# EAGLE design MainBoard (EAGLE 9.5.1)

## Sheet 1 of 5
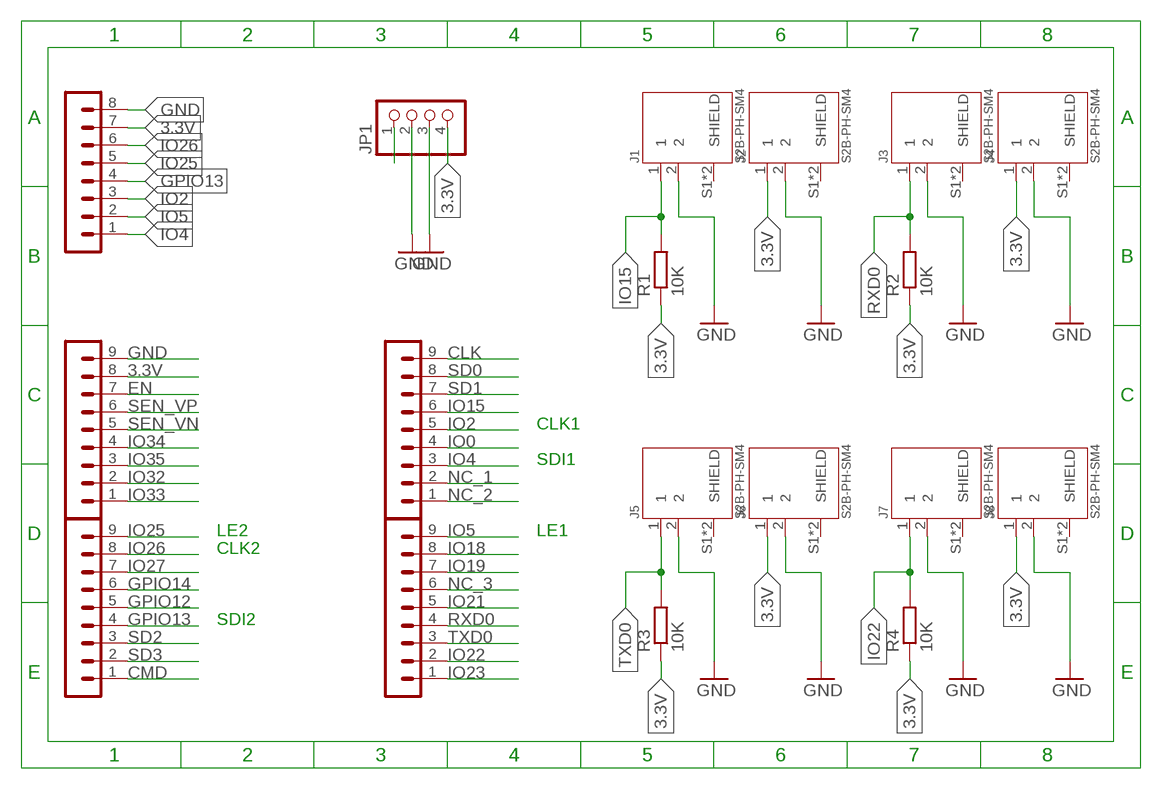
[diagram p0: schematic, sheet 1]

### Parts
J1  S2B-PH-SM4  [JST_S2B-PH-SM4-TB(LF)(SN)]
J2  S2B-PH-SM4  [JST_S2B-PH-SM4-TB(LF)(SN)]
J3  S2B-PH-SM4  [JST_S2B-PH-SM4-TB(LF)(SN)]
J4  S2B-PH-SM4  [JST_S2B-PH-SM4-TB(LF)(SN)]
J5  S2B-PH-SM4  [JST_S2B-PH-SM4-TB(LF)(SN)]
J6  S2B-PH-SM4  [JST_S2B-PH-SM4-TB(LF)(SN)]
J7  S2B-PH-SM4  [JST_S2B-PH-SM4-TB(LF)(SN)]
J8  S2B-PH-SM4  [JST_S2B-PH-SM4-TB(LF)(SN)]
JP1  PINHD-1X4  [1X04]
R1  10K  R-EU_1206R1206  [R1206]
R2  10K  R-EU_1206R1206  [R1206]
R3  10K  R-EU_1206R1206  [R1206]
R4  10K  R-EU_1206R1206  [R1206]
SV2  PINHEADER-1X9  [MA09-1]
SV3  PINHEADER-1X9  [MA09-1]
SV4  PINHEADER-1X8  [MA08-1]
SV5  PINHEADER-1X9  [MA09-1]
SV6  PINHEADER-1X9  [MA09-1]

### Nets
3.3V: J2.1 J4.1 J6.1 J8.1 JP1.4 R1.1 R2.1 R3.1 R4.1 SV4.7 SV5.8
CLK: SV2.9
CMD: SV6.1
EN [other]: SV5.7
GND: J1.2 J2.2 J3.2 J4.2 J5.2 J6.2 J7.2 J8.2 JP1.2 JP1.3 SV4.8 SV5.9
GPIO12: SV6.5
GPIO13: SV4.4 SV6.4
GPIO14: SV6.6
IO0 [other]: SV2.4
IO2: SV2.5 SV4.3
IO4: SV2.3 SV4.1
IO5: SV3.9 SV4.2
IO15: J1.1 R1.2 SV2.6
IO18: SV3.8
IO19: SV3.7
IO21: SV3.5
IO22: J7.1 R4.2 SV3.2
IO23: SV3.1
IO25: SV4.5 SV6.9
IO26: SV4.6 SV6.8
IO27: SV6.7
IO32: SV5.2
IO33: SV5.1
IO34: SV5.4
IO35: SV5.3
NC: JP1.1
NC_1: SV2.2
NC_2: SV2.1
NC_3: SV3.6
RXD0 [other]: J3.1 R2.2 SV3.4
SD0: SV2.8
SD1: SV2.7
SD2: SV6.3
SD3: SV6.2
SEN_VN: SV5.5
SEN_VP: SV5.6
TXD0 [other]: J5.1 R3.2 SV3.3
Unconnected: J1.S1(SHIELD) J1.S2(SHIELD) J2.S1(SHIELD) J2.S2(SHIELD) J3.S1(SHIELD) J3.S2(SHIELD) J4.S1(SHIELD) J4.S2(SHIELD) J5.S1(SHIELD) J5.S2(SHIELD) J6.S1(SHIELD) J6.S2(SHIELD) J7.S1(SHIELD) J7.S2(SHIELD) J8.S1(SHIELD) J8.S2(SHIELD)

### Notes on the sheet
- CLK1
- SDI1
- LE2 | LE1
- CLK2
- SDI2

## Sheet 2 of 5
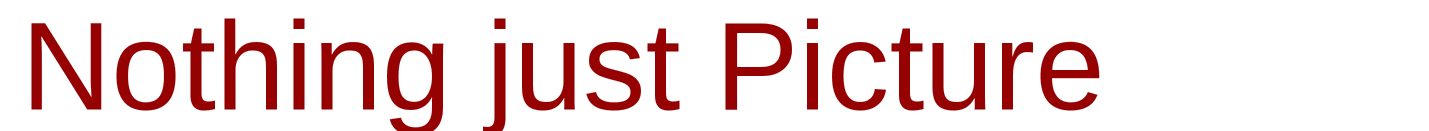
[diagram p1: schematic, sheet 2]

### Notes on the sheet
- Nothing just Picture

## Sheet 3 of 5

## Sheet 4 of 5
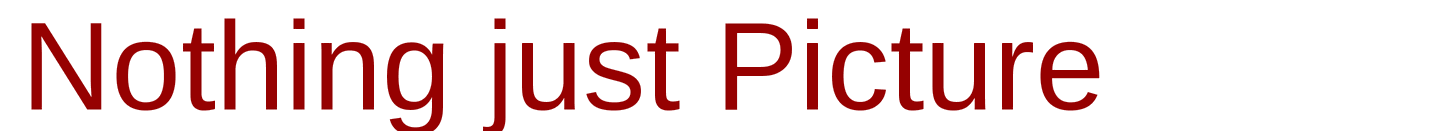
[diagram p2: schematic, sheet 4]

### Notes on the sheet
- Nothing just Picture

## Sheet 5 of 5

## Library data of the parts
J1-J8 = CommonParts:S2B-PH-SM4: PH Series 2 Position 2 mm Pitch Surface Mount Side Entry Shrouded Header; DESCRIPTION: PH Series 2 Position 2 mm Pitch Surface Mount Side Entry Shrouded Header; DIGI-KEY_PART_NUMBER: 455-1749-1-ND; DIGI-KEY_PURCHASE_URL: https://www.digikey.com/product-detail/en/jst-sales-america-inc/S2B-PH-SM4-TB_LF__SN_/455-1749-1-ND/926846?utm_source=snapeda&utm_medium=aggregator&utm_campaign=symbol; MF: JST Sales; MP: S2B-PH-SM4-TB_LF__SN_; PACKAGE: None
JP1 = pinhead:PINHD-1X4: PIN HEADER
R1-R4 = CommonParts:R-EU_1206: RESISTOR, European symbol
SV2 SV3 SV5 SV6 = CommonParts:PINHEADER-1X9: PIN HEADER; OC_FARNELL: unknown; OC_NEWARK: unknown
SV4 = CommonParts:PINHEADER-1X8: PIN HEADER; OC_FARNELL: unknown; OC_NEWARK: unknown

## Net classes
0 default: width 0.2 mm, drill 0.6 mm, clearance 0.2 mm
1 other: width 0.2 mm, drill 0.2 mm, clearance 0.1 mm

## Board
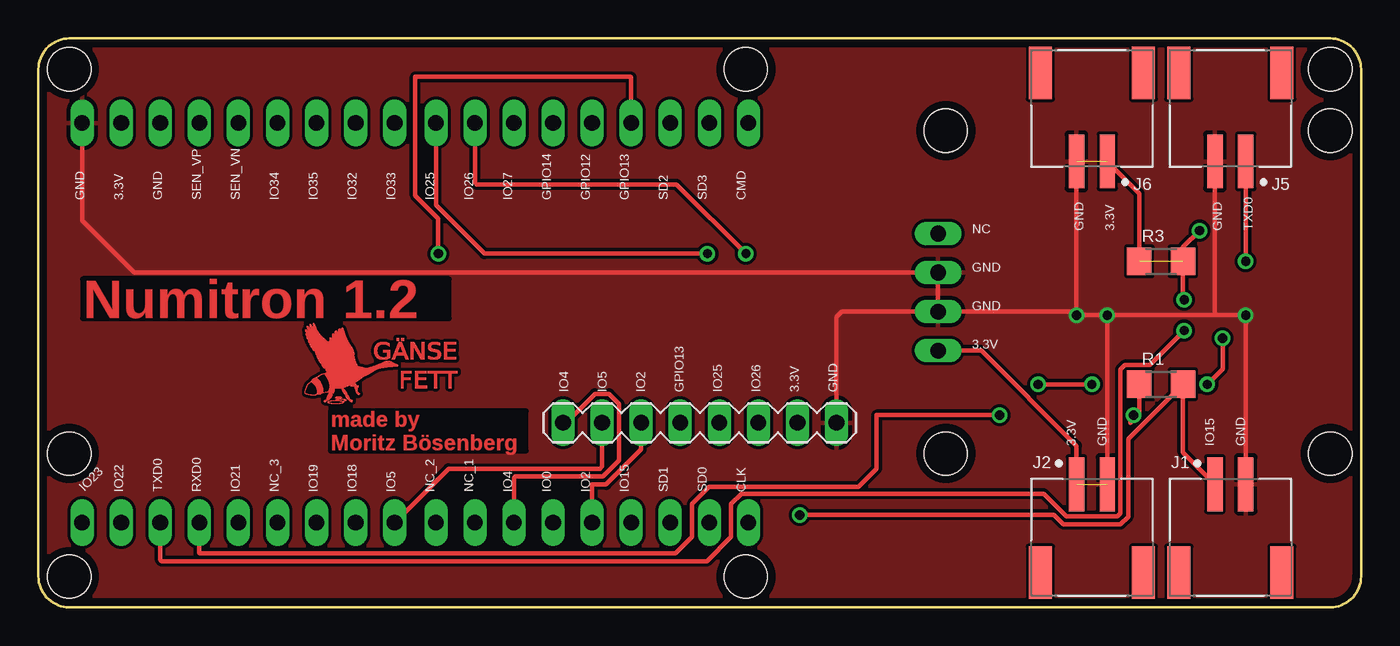
[diagram p3: board, top side]
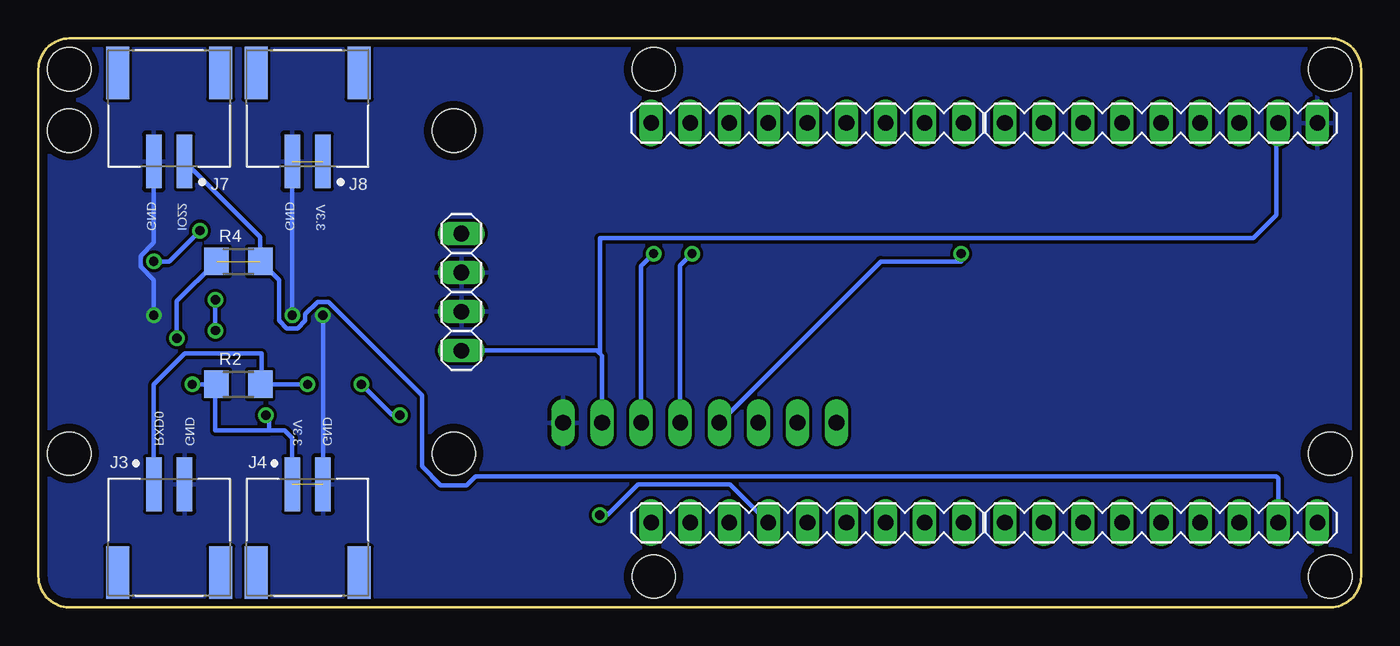
[diagram p4: board, bottom side, seen from below]

Size 86 x 37 mm. Coordinates in mm from the lower left corner, seen from the top.
Outline: 2,37 84,37 arc-90 86,35 86,2 arc-90 84,0 2,0 arc-90 0,2 0,35 arc-90 2,37
Copper layers (1*16): Top 0.035mm / dielectric 1.5mm / Bottom 0.035mm
Design rules "default *": minimum track width 6mil, minimum drill 0.35mm, track to track 6mil, track to pad 6mil, pad to pad 6mil, via to via 6mil, smd to smd 6mil, copper to edge 20mil, drill to drill 6mil, minimum pad ring 10mil, minimum via ring 8mil, stop-mask expansion 4mil, vias tented up to drill 0mil, thermal gap 10mil
Holes 2.8 mm at 2,10 2,35 84,35 84,10 59,31 59,10 84,31 2,2 46,2 46,35
tKeepout: area 17.3,13.9 to 17.3,14.1; area 17.3,18 to 17.3,18; area 17.3,13.9 to 17.3,14.1; area 17.3,18 to 17.4,18.1; area 17.3,14 to 17.4,14.2; area 17.3,13.9 to 17.4,14; area 17.4,17.9 to 17.4,18.1; area 17.4,14.1 to 17.4,14.2; area 17.4,13.9 to 17.4,13.9; area 17.4,17.9 to 17.4,18.1; area 17.4,17.7 to 17.4,17.8; area 17.4,14.1 to 17.4,14.2; 2280 more areas
bKeepout: area 68.4,-5.9 to 68.4,-5.7; area 68.4,-1.8 to 68.4,-1.8; area 68.4,-5.9 to 68.4,-5.7; area 68.4,-1.8 to 68.5,-1.7; area 68.4,-5.8 to 68.5,-5.6; area 68.4,-5.9 to 68.5,-5.8; area 68.5,-1.9 to 68.5,-1.7; area 68.5,-5.7 to 68.5,-5.6; area 68.5,-5.9 to 68.5,-5.9; area 68.5,-1.9 to 68.5,-1.7; area 68.5,-2.1 to 68.5,-2; area 68.5,-5.7 to 68.5,-5.6; 2280 more areas

### Footprints (pad centres in the part's own frame; a part is rotated, then mirrored left to right if it is on the bottom)
JST_S2B-PH-SM4-TB(LF)(SN) = smd 1 x 3.5: 1 -1,0; 2 1,0 | smd 1.5 x 3.4: S1 -3.35,-5.75; S2 3.35,-5.75
1X04 = drill 1.016 long: 1 -3.81,0; 2 -1.27,0; 3 1.27,0; 4 3.81,0
R1206 = smd 1.6 x 1.803: 1 -1.422,0; 2 1.422,0
MA09-1 = drill 1.016 long: 1 -10.16,0; 2 -7.62,0; 3 -5.08,0; 4 -2.54,0; 5 0,0; 6 2.54,0; 7 5.08,0; 8 7.62,0; 9 10.16,0
MA08-1 = drill 1.016 long: 1 -8.89,0; 2 -6.35,0; 3 -3.81,0; 4 -1.27,0; 5 1.27,0; 6 3.81,0; 7 6.35,0; 8 8.89,0

### Placement (x,y rotation side)
J1  77.5,8 0 top
J2  68.5,8 0 top
J3  77.5,8 0 bottom
J4  68.5,8 0 bottom
J5  77.5,29 180 top
J6  68.5,29 180 top
J7  77.5,29 180 bottom
J8  68.5,29 180 bottom
JP1  58.5,20.5 270 bottom
R1  [R1206]  73,14.5 0 top
R2  [R1206]  73,14.5 0 bottom
R3  [R1206]  73,22.5 0 top
R4  [R1206]  73,22.5 0 bottom
SV2  36,5.5 180 bottom
SV3  13,5.5 180 bottom
SV4  43,12 0 top
SV5  13,31.5 0 bottom
SV6  36,31.5 0 bottom

### Tracks (layer width: path | path; a pad name or v marks a point on that pad's centre or on a via)
3.3V  (via drill 0.6)  (3 unrouted)
  Top 0.305: J2.1 67.5,10.5 61.31,16.69 JP1.4 | R3.1 71.58,26.92 J6.1 | R1.1 71.58,12.58 71,12 71,12.29 v71.21,12.5 | v77,17.5 77,15.5 v76,14.5
  Bottom 0.305: J4.1 69.5,11 70,11.5 71,11.5 | 71,11.5 74.5,11.5 74.5,14.42 R2.1 v76,14.5 | v71.21,12.5 71,12.29 71,11.5 | R4.1 77,19.92 v77,17.5 | JP1.4 49.69,16.69 49.5,16.5 | SV4.7 49.35,16.35 49.5,16.5 | SV5.8 5.5,31.38 5.5,25.5 7,24 49.5,24 49.5,16.5
GND  (via drill 0.6)
  Top 0.305: J6.2 v67.5,19 | JP1.3 67.27,19.23 v67.5,19 | SV4.8 51.89,18.89 52.23,19.23 JP1.3 | SV5.9 2.84,25.16 6.23,21.77 JP1.2 JP1.3 | J1.2 v78.5,19 76.5,19 | 76.5,19 v69.5,19 | v69.5,19 v67.5,19 | J2.2 v69.5,19 | J5.2 76.5,19
  Bottom 0.305: J7.2 78.5,23.71 79.36,22.85 79.36,22.15 78.5,21.29 v78.5,19 | J8.2 v69.5,19 | J4.2 v67.5,19
  pour Top: 0,37 86,37 86,0 0,0
  pour Bottom: 0,37 86,37 86,0 0,0
GPIO13  (via drill 0.6)
  Top 0.305: v26,23 26,25.29 24.5,26.79 24.5,34.5 38.5,34.5 38.54,34.46 SV6.4
  Bottom 0.305: SV4.4 31.23,22.5 26,22.5 v26,23
IO2
  Top 0.305: SV4.3 39.19,10.26 36.92,7.99 36,7.99 SV2.5
IO4
  Top 0.305: SV4.1 34.31,12 36.19,13.88 37.11,13.88 37.76,13.22 37.76,9.55 36.71,8.49 31,8.49 30.92,8.41 SV2.3
IO5
  Top 0.305: SV3.9 26.66,9 36.5,9 36.65,9.15 SV4.2
IO15  (via drill 0.6)
  Top 0.305: J1.1 74.42,10.08 R1.2 70.86,10.94 70.86,5.89 70.36,5.39 66.64,5.39 66.04,6 v49.5,6
  Bottom 0.305: v49.5,6 49,6 47.01,8 41.03,8 SV2.6
IO22
  Bottom 0.305: J7.1 71.58,24.08 R4.2 70.36,21.28 70.36,18.65 69.85,18.14 69.15,18.14 68.64,18.65 68.64,19.07 67.85,19.86 67.15,19.86 61.06,13.77 61.06,9.15 59.85,7.94 58.15,7.94 57.59,8.5 5.5,8.5 5.38,8.38 SV3.2
IO25  (via drill 0.6)
  Top 0.305: v43.5,23 29,23 25.84,26.16 SV6.9
  Bottom 0.305: SV4.5 44.27,22.23 v43.5,23
IO26  (via drill 0.6)
  Top 0.305: v46,23 41.5,27.5 28.5,27.5 28.38,27.62 SV6.8
  Bottom 0.305: SV4.6 46.81,22.19 v46,23
RXD0  (via drill 0.6)
  Top 0.305: v68.5,14.5 v65,14.5 | v62.5,12.5 54.5,12.5 54.5,9 53.33,7.83 43.62,7.83 42.51,6.72 42.51,4.59 41.42,3.5 10.5,3.5 10.46,3.54 SV3.4
  Bottom 0.305: J3.1 78.5,14.5 76.5,16.5 71.5,16.5 71.5,14.58 R2.2 v68.5,14.5 | v65,14.5 63,12.5 v62.5,12.5
TXD0  (via drill 0.6)
  Top 0.305: J5.1 v78.5,22.5 | v75.5,24.5 74.42,23.42 R3.2 74.42,20.08 v74.5,20 | v74.5,18 72.25,15.75 70.63,15.75 70.35,15.47 70.35,6.1 70.15,5.9 66.85,5.9 65.38,7.38 45.7,7.38 45.05,6.72 45.05,4.59 43.46,3 8,3 7.92,3.08 SV3.3
  Bottom 0.305: v78.5,22.5 77.5,22.5 v75.5,24.5 | v74.5,20 v74.5,18
(copper drawn outside any net)
  shapes: Top area x2292

### Text on the board
Top: Numitron 1.2 | made by / Moritz Bösenberg | made by / Moritz Bösenberg
tNames: GND | 3.3V | GND | SEN_VP | SEN_VN | IO34 | IO35 | IO32 | IO33 | IO25 | IO26 | IO27 | GPIO14 | GPIO12 | GPIO13 | SD2 | SD3 | CMD | NC | GND | 3.3V | GND | TXD0 | GND | GND | 3.3V | IO4 | IO5 | IO2 | GPIO13 | IO25 | IO26 | 3.3V | GND | 3.3V | GND | IO15 | GND | IO23 | IO22 | TXD0 | RXD0 | IO21 | NC_3 | IO19 | IO18 | IO5 | NC_2 | NC_1 | IO4 | IO0 | IO2 | IO15 | SD1 | SD0 | CLK
bNames: 3.3V | GND | IO22 | GND | GND | 3.3V | GND | RXD0
tStop: Numitron 1.2 | made by / Moritz Bösenberg
tKeepout: Numitron 1.2 | made by / Moritz Bösenberg